# Altium schematic sheet hbridge.SchDoc
size A4
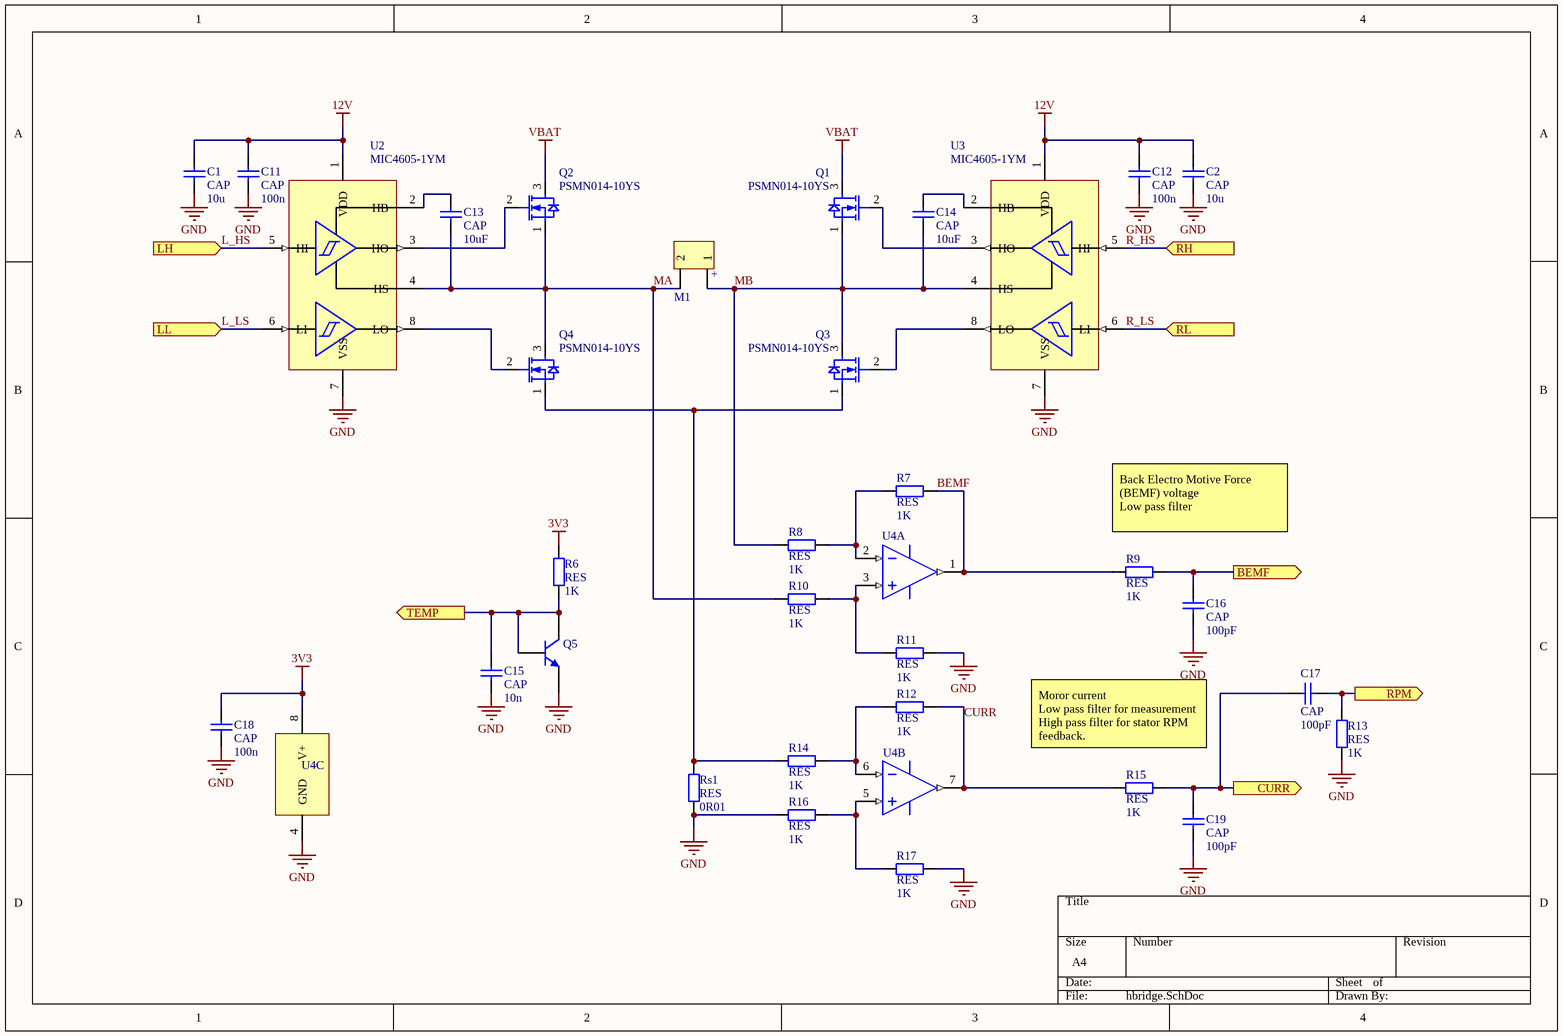
[diagram p0: hbridge.SchDoc]

## Parts
C1  CAP  value 10u  [CAPC2012X11M]
C2  CAP  value 10u  [CAPC2012X11M]
C11  CAP  value 100n  [CAPC1608X08M]
C12  CAP  value 100n  [CAPC1608X08M]
C13  CAP  value 10uF  [CAPC1608X08M]
C14  CAP  value 10uF  [CAPC1608X08M]
C15  CAP  value 10n  [CAPC1608X08M]
C16  CAP  value 100pF  [CAPC1608X08M]
C17  CAP  value 100pF  [CAPC1608X08M]
C18  CAP  value 100n  [CAPC1608X08M]
C19  CAP  value 100pF  [CAPC1608X08M]
M1  VBAT  [BAT_CNCTR]  (value not drawn)
Q1  PSMN014-10YS  [AGV_PWRSO2]
Q2  PSMN014-10YS  [AGV_PWRSO2]
Q3  PSMN014-10YS  [AGV_PWRSO2]
Q4  PSMN014-10YS  [AGV_PWRSO2]
Q5  (no value)  [SOT23]
R6  RES  value 1K  [RESC1608X06M]
R7  RES  value 1K  [RESC1608X06M]
R8  RES  value 1K  [RESC1608X06M]
R9  RES  value 1K  [RESC1608X06M]
R10  RES  value 1K  [RESC1608X06M]
R11  RES  value 1K  [RESC1608X06M]
R12  RES  value 1K  [RESC1608X06M]
R13  RES  value 1K  [RESC1608X06M]
R14  RES  value 1K  [RESC1608X06M]
R15  RES  value 1K  [RESC1608X06M]
R16  RES  value 1K  [RESC1608X06M]
R17  RES  value 1K  [RESC1608X06M]
Rs1  RES  value 0R01  [RESC2012X07M]
U2  MIC4605-1YM  [SOIC8]
U3  MIC4605-1YM  [SOIC8]
U4  (no value)  [TSSOP8]  (parts A,B,C of 3)

## Ports
BEMF (out), CURR (out), LH (in), LL (in), RH (in), RL (in), RPM (out), TEMP (out)

## Nets
3V3: C18.2 R6.2 U4.8(V+)
12V: C1.2 C2.2 C11.2 C12.2 U2.1(VDD) U3.1(VDD)
GND: C1.1 C2.1 C11.1 C12.1 C15.1 C16.1 C18.1 C19.1 Q5.1(E) R11.2 R13.2 R16.1 R17.2 Rs1.1 U2.7(VSS) U3.7(VSS) U4.4(GND)
VBAT: Q1.3(D) Q2.3(D)
BEMF: R7.2 R9.1 U4.1(OUTA)
BEMF: C16.2 R9.2 ; port BEMF  [a separate net that carries the same name]
CURR: R12.2 R15.1 U4.7(OUTB)
CURR: C17.1 C19.2 R15.2 ; port CURR  [a separate net that carries the same name]
L_HS: U2.5(HI) ; port LH
L_LS: U2.6(LI) ; port LL
MA: C13.1 M1.2 Q2.1(S) Q4.3(D) R10.1 U2.4(HS)
MB: C14.1 M1.1 Q1.1(S) Q3.3(D) R8.1 U3.4(HS)
R_HS: U3.5(HI) ; port RH
R_LS: U3.6(LI) ; port RL
RPM: C17.2 R13.1 ; port RPM
TEMP: C15.2 Q5.2(B) Q5.3(C) R6.1 ; port TEMP
NetC13_2: C13.2 U2.2(HB)
NetC14_2: C14.2 U3.2(HB)
NetQ1_2: Q1.2(D) U3.3(HO)
NetQ2_2: Q2.2(D) U2.3(HO)
NetQ3_1: Q3.1(S) Q4.1(S) R14.1 Rs1.2
NetQ3_2: Q3.2(D) U3.8(LO)
NetQ4_2: Q4.2(D) U2.8(LO)
NetR7_1: R7.1 R8.2 U4.2(INA-)
NetR10_2: R10.2 R11.1 U4.3(INA+)
NetR12_1: R12.1 R14.2 U4.6(INB-)
NetR16_2: R16.2 R17.1 U4.5(INB+)

## Notes on the sheet
- (near R9) Back Electro Motive Force (BEMF) voltage
  Low pass filter
- (near R15) Moror current
  Low pass filter for measurement
  High pass filter for stator RPM feedback.
- (in symbol BAT_CNCTR) +

## Library data of the parts
C1 C2 C11-C19 = CAP: Capacitor; Published: 8-Jun-2000; LatestRevisionDate: 17-Jul-2002; LatestRevisionNote: Re-released for DXP Platform.; PackageReference: RB7.6-15; Publisher: Altium Limited; PackageDescription: Polarized Capacitor (Radial); 2 Leads
M1 = BAT_CNCTR: 2-pin batteri kontakt
Q5 = 2N3904: NPN General Purpose Amplifier; pin to pad: 1>2 2>1; Published: 8-Jun-2000; LatestRevisionDate: 15-Jan-2003; LatestRevisionNote: PCB Footprint 'BCY-W3/D4.7' replaced; DatasheetVersion: 1997; PackageVersion: Sep-1998; PackageReference: TO-92A; Publisher: Altium Limited; PackageDescription: TO, Flat Index; 3 In-Line, Axial Leads; Body Dia. 4.5mm; Leads 0.51 x 0.48 mm (max); ComponentLink1Description: Manufacturer Link; ComponentLink1URL: http://www.fairchildsemi.com/; ComponentLink2Description: Datasheet; ComponentLink2URL: http://www.fairchildsemi.com/ds/2N%2F2N3904.pdf
R6-R17 Rs1 = RES: Resistor; Published: 8-Jun-2000; LatestRevisionDate: 17-Jul-2002; LatestRevisionNote: Re-released for DXP Platform.; PackageReference: AXIAL-0.4; Publisher: Altium Limited; PackageDescription: Axial Device, Thru-Hole; 2 Leads; 0.4 in Pin Spacing
U4 = LM358PWR: Low Power Dual Operational Amplifier, 8-pin Narrow SOIC; PartNumber: LM358AM; Manufacturer: National Semiconductor; PackageTopMarking: NSZXTT*LM*358AM; PowerWise: N; CompType: Amplifiers; Published: 4-Dec-2008; LatestRevisionDate: 13-Jan-2009; LatestRevisionNote: Sim Model Added.; DatasheetVersion: Oct-2005; PackageVersion: revM, May-2009; PackageReference: M08A; Publisher: Altium Limited; PackageDescription: SOIC Narrow, 4.9 x 3.9 x 1.45mm, 8 Lead, 1.27mm Pitch; Supplier 1: Farnell; Supplier Part Number 1: 9486801; RoHS: N; PinCount: 8; Code_JEDEC: MS-012-AA; Code_IPC: SOIC127P600-8; ComponentLink1Description: LM358 Datasheet; ComponentLink1URL: http://www.national.com/ds/LM/LM358.pdf; ComponentLink2Description: LM358 Web Page; ComponentLink2URL: http://www.national.com/pf/LM/LM358.html; ComponentLink3Description: M08A Package Page; ComponentLink3URL: http://www.national.com/packaging/folders/m08a.html
Q1-Q4 = PSMN014-10YS: Published: 8-Jun-2000; LatestRevisionDate: 17-Jul-2002; LatestRevisionNote: Re-released for DXP Platform.; PackageVersion: 1995/1996; PackageReference: E3; Publisher: Altium Limited; PackageDescription: TO, Flat Index; 3 In-Line, Axial Leads; Body Dia. 4.6mm; Lead Dia. 0.5 mm (max)